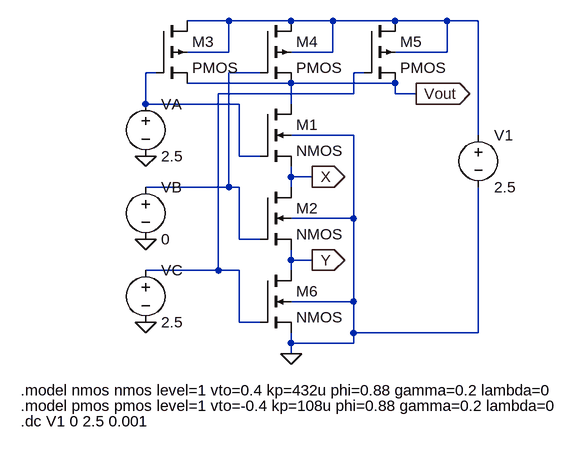
[diagram p0: schematic Lab04Pt2.asc]
Lab04Pt2.asc, the LTspice schematic file:
Version 4
SHEET 1 880 680
WIRE -48 -80 -112 -80
WIRE 48 -80 -48 -80
WIRE 112 -80 48 -80
WIRE 208 -80 112 -80
WIRE 288 -80 208 -80
WIRE 336 -80 288 -80
WIRE -48 -32 -48 -80
WIRE -48 -32 -112 -32
WIRE 112 -32 112 -80
WIRE 112 -32 48 -32
WIRE 288 -32 288 -80
WIRE 288 -32 208 -32
WIRE -160 0 -176 0
WIRE 0 0 -48 0
WIRE 160 0 144 0
WIRE 48 16 -112 16
WIRE 208 16 48 16
WIRE 144 32 144 0
WIRE 144 32 -64 32
WIRE 208 32 208 16
WIRE 240 32 208 32
WIRE -176 48 -176 0
WIRE -32 48 -176 48
WIRE 48 48 48 16
WIRE 144 96 48 96
WIRE 336 96 336 -80
WIRE -32 128 -32 48
WIRE 0 128 -32 128
WIRE 48 160 48 144
WIRE 80 160 48 160
WIRE -48 176 -48 0
WIRE -48 176 -176 176
WIRE -32 176 -48 176
WIRE 48 176 48 160
WIRE 144 224 144 96
WIRE 144 224 48 224
WIRE -32 256 -32 176
WIRE 0 256 -32 256
WIRE 48 288 48 272
WIRE 80 288 48 288
WIRE -64 304 -64 32
WIRE -64 304 -176 304
WIRE -32 304 -64 304
WIRE 48 304 48 288
WIRE 144 352 144 224
WIRE 144 352 48 352
WIRE -32 384 -32 304
WIRE 0 384 -32 384
WIRE 144 400 144 352
WIRE 336 400 336 176
WIRE 336 400 144 400
WIRE 48 416 48 400
WIRE 144 416 144 400
WIRE 144 416 48 416
WIRE 48 432 48 416
FLAG 48 432 0
FLAG -176 384 0
FLAG 80 160 X
IOPIN 80 160 Out
FLAG 80 288 Y
IOPIN 80 288 Out
FLAG 240 32 Vout
IOPIN 240 32 Out
FLAG -176 128 0
FLAG -176 256 0
SYMBOL nmos4 0 48 R0
SYMATTR InstName M1
SYMATTR Value2 l=0.1u w=6u
SYMBOL nmos4 0 176 R0
SYMATTR InstName M2
SYMATTR Value2 l=0.1u w=6u
SYMBOL pmos4 -160 -80 R0
SYMATTR InstName M3
SYMATTR Value2 l=0.1u w=2.65u
SYMBOL pmos4 0 -80 R0
SYMATTR InstName M4
SYMATTR Value2 l=0.1u w=2.65u
SYMBOL pmos4 160 -80 R0
SYMATTR InstName M5
SYMATTR Value2 l=0.1u w=2.65u
SYMBOL nmos4 0 304 R0
SYMATTR InstName M6
SYMATTR Value2 l=0.1u w=6u
SYMBOL voltage 336 80 R0
SYMATTR InstName V1
SYMATTR Value 2.5
SYMBOL voltage -176 288 R0
WINDOW 123 0 0 Left 0
WINDOW 39 0 0 Left 0
SYMATTR InstName VC
SYMATTR Value 2.5
SYMBOL voltage -176 32 R0
WINDOW 123 0 0 Left 0
WINDOW 39 0 0 Left 0
SYMATTR InstName VA
SYMATTR Value 2.5
SYMBOL voltage -176 160 R0
WINDOW 123 0 0 Left 0
WINDOW 39 0 0 Left 0
SYMATTR InstName VB
SYMATTR Value 0
TEXT -368 488 Left 2 !.model nmos nmos level=1 vto=0.4 kp=432u phi=0.88 gamma=0.2 lambda=0
TEXT -368 512 Left 2 !.model pmos pmos level=1 vto=-0.4 kp=108u phi=0.88 gamma=0.2 lambda=0
TEXT -368 536 Left 2 !.dc V1 0 2.5 0.001

The netlist it stands for:
* Lab04Pt2.asc
M1 Vout N002 X 0 NMOS l=0.1u w=6u
M2 X N003 Y 0 NMOS l=0.1u w=6u
M3 N001 N002 Vout N001 PMOS l=0.1u w=2.65u
M4 N001 N003 Vout N001 PMOS l=0.1u w=2.65u
M5 N001 N004 Vout N001 PMOS l=0.1u w=2.65u
M6 Y N004 0 0 NMOS l=0.1u w=6u
V1 N001 0 2.5
VC N004 0 2.5
VA N002 0 2.5
VB N003 0 0
.model NMOS NMOS
.model PMOS PMOS
.lib standard.mos
.model nmos nmos level=1 vto=0.4 kp=432u phi=0.88 gamma=0.2 lambda=0
.model pmos pmos level=1 vto=-0.4 kp=108u phi=0.88 gamma=0.2 lambda=0
.dc V1 0 2.5 0.001
.backanno
.end

* Results of the author's LTspice run, read from the files saved beside the schematic
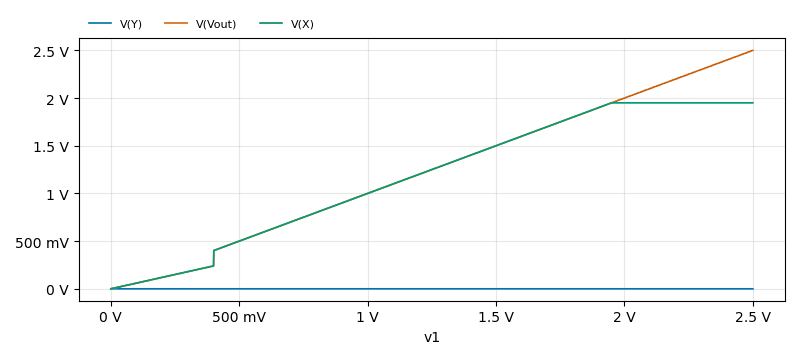
[diagram p1: DC transfer characteristic of Lab04Pt2.asc, plotted from the saved traces]
* DC transfer characteristic, 1 run:
*   V(Y): 1.845e-15 fV at v1=0 V, 35.83 pV at v1=2.5 V, min 1.845e-15 fV, max 35.84 pV
*   V(Vout): 0.0001029 fV at v1=0 V, 2.5 V at v1=2.5 V, min 0.0001029 fV, max 2.5 V
*   V(X): 0.0001029 fV at v1=0 V, 1.95 V at v1=2.5 V, min 0.0001029 fV, max 1.951 V